# Altium schematic sheet LEFT_MOTOR.SchDoc
size A4; SheetNumber: 2; SheetTotal: 3
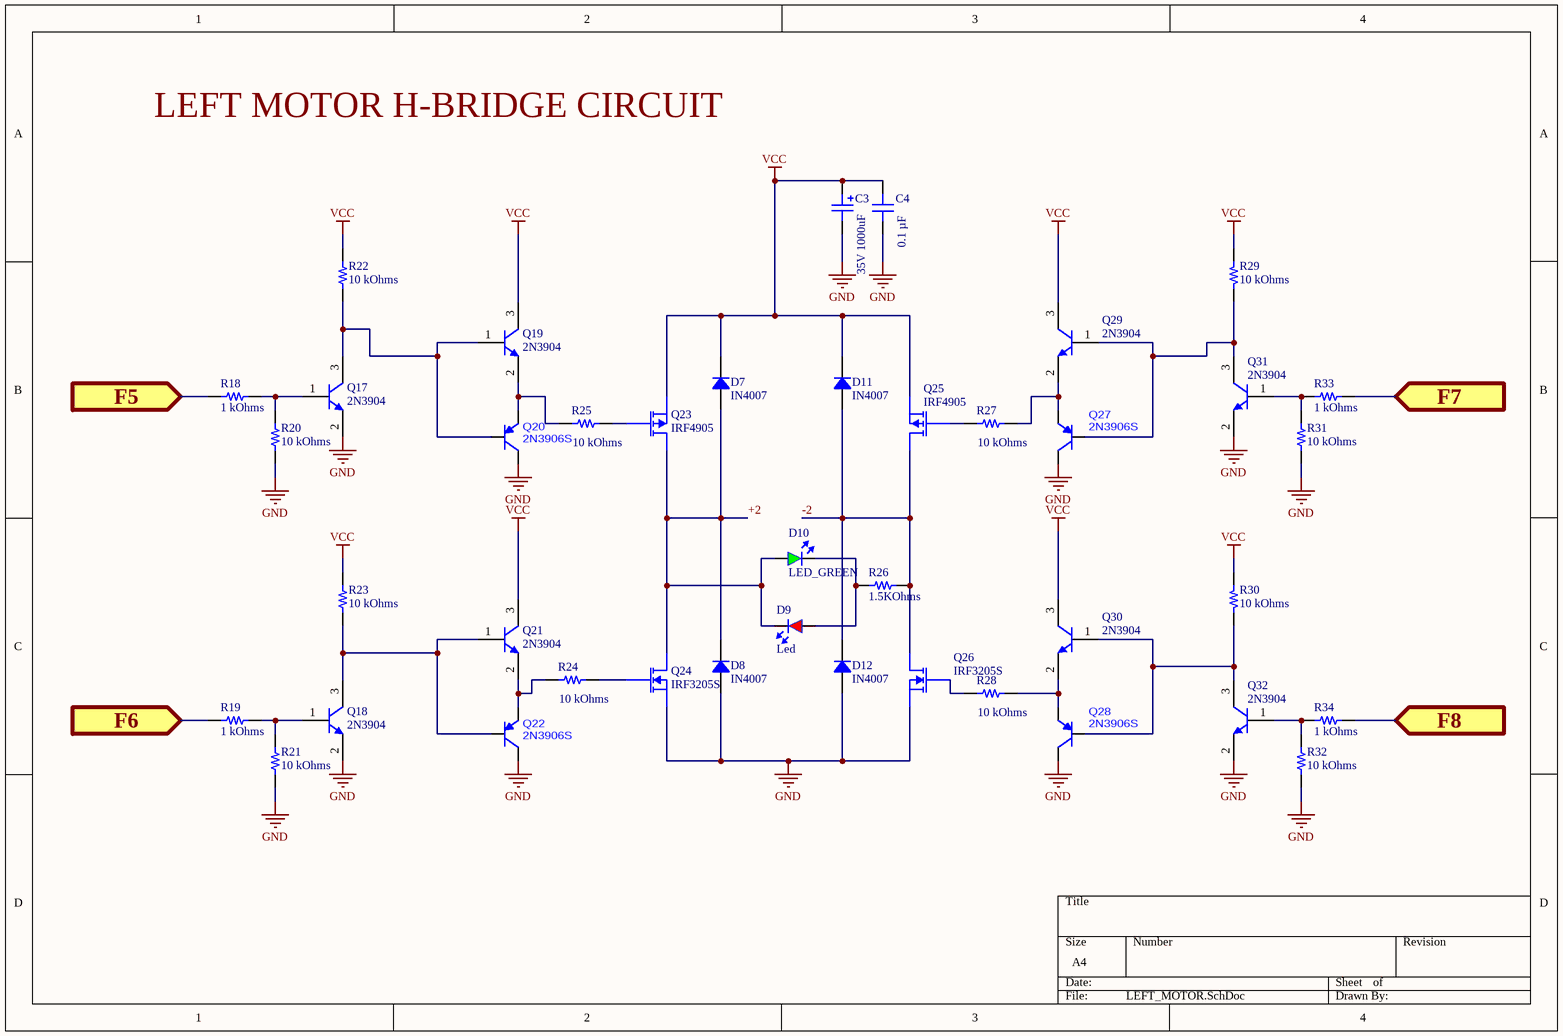
[diagram p0: LEFT_MOTOR.SchDoc]

## Parts
C3  35V 1000uF  [35V 1000uF]
C4  0.1 µF  [CAP 1210_3225 - 1MM]
D7  IN4007  [DO214AC SMA]
D8  IN4007  [DO214AC SMA]
D9  Led  [LED_RED]
D10  LED_GREEN  [LED_GREEN]
D11  IN4007  [DO214AC SMA]
D12  IN4007  [DO214AC SMA]
Q17  2N3904  [DIODES SOT-23-3]
Q18  2N3904  [DIODES SOT-23-3]
Q19  2N3904  [DIODES SOT-23-3]
Q20  2N3906S  [SOT23-3]
Q21  2N3904  [DIODES SOT-23-3]
Q22  2N3906S  [SOT23-3]
Q23  IRF4905  [IRF4905]
Q24  IRF3205S  [IRF3205S]
Q25  IRF4905  [IRF4905]
Q26  IRF3205S  [IRF3205S]
Q27  2N3906S  [SOT23-3]
Q28  2N3906S  [SOT23-3]
Q29  2N3904  [DIODES SOT-23-3]
Q30  2N3904  [DIODES SOT-23-3]
Q31  2N3904  [DIODES SOT-23-3]
Q32  2N3904  [DIODES SOT-23-3]
R18  1 kOhms  [RES 1206_3216]
R19  1 kOhms  [RES 1206_3216]
R20  10 kOhms  [RES 1206_3216]
R21  10 kOhms  [RES 1206_3216]
R22  10 kOhms  [RES 1210_3225]
R23  10 kOhms  [RES 1210_3225]
R24  10 kOhms  [RES 1210_3225]
R25  10 kOhms  [RES 1210_3225]
R26  1.5KOhms  [RES 1210_3225]
R27  10 kOhms  [RES 1210_3225]
R28  10 kOhms  [RES 1210_3225]
R29  10 kOhms  [RES 1210_3225]
R30  10 kOhms  [RES 1210_3225]
R31  10 kOhms  [RES 1206_3216]
R32  10 kOhms  [RES 1206_3216]
R33  1 kOhms  [RES 1206_3216]
R34  1 kOhms  [RES 1206_3216]

## Ports
F5 (in, see LOGIC AND POWER[2D]), F6 (in, see LOGIC AND POWER[2C], LOGIC AND POWER[2D]), F7 (in, see LOGIC AND POWER[2D]), F8 (in, see LOGIC AND POWER[2C], LOGIC AND POWER[2D])

## Nets
GND: C3.2(out) C4.1 D8.1 D12.1 Q17.2(E) Q18.2(E) Q20.3(C) Q22.3(C) Q24.3(S) Q26.3(S) Q27.3(C) Q28.3(C) Q31.2(E) Q32.2(E) R20.1 R21.1 R31.1 R32.1
VCC: C3.1(in) C4.2 D7.2 D11.2 Q19.3(C) Q21.3(C) Q23.3(S) Q25.3(S) Q29.3(C) Q30.3(C) R22.1 R23.1 R29.1 R30.1
+2: D7.1 D8.2 D9.2(OUT) D10.1(IN) Q23.2(D) Q24.2(D)
-2: D11.1 D12.2 Q25.2(D) Q26.2(D) R26.2
F5: R18.1 ; port F5
F6: R19.1 ; port F6
F7: R33.2 ; port F7
F8: R34.2 ; port F8
NetD9_1: D9.1(IN) D10.2(OUT) R26.1
NetQ17_1: Q17.1(B) R18.2 R20.2
NetQ17_3: Q17.3(C) Q19.1(B) Q20.1(B) R22.2
NetQ18_1: Q18.1(B) R19.2 R21.2
NetQ18_3: Q18.3(C) Q21.1(B) Q22.1(B) R23.2
NetQ19_2: Q19.2(E) Q20.2(E) R25.1
NetQ21_2: Q21.2(E) Q22.2(E) R24.1
NetQ23_1: Q23.1(G) R25.2
NetQ24_1: Q24.1(G) R24.2
NetQ25_1: Q25.1(G) R27.1
NetQ26_1: Q26.1(G) R28.1
NetQ27_1: Q27.1(B) Q29.1(B) Q31.3(C) R29.2
NetQ27_2: Q27.2(E) Q29.2(E) R27.2
NetQ28_1: Q28.1(B) Q30.1(B) Q32.3(C) R30.2
NetQ28_2: Q28.2(E) Q30.2(E) R28.2
NetQ31_1: Q31.1(B) R31.2 R33.1
NetQ32_1: Q32.1(B) R32.2 R34.1

## Notes on the sheet
- Labels drawn without touching a wire or pin: LEFT MOTOR H-BRIDGE CIRCUIT

## Library data of the parts
C4 = 1210Y0500104KST: 1210 50VDC 100NF 10% X7R(2R1) AE; manufacturer: Knowles Syfer; Voltage - Rated: 50V; Part Number: 1210Y0500104KST; Value: 0.1 µF; Applications: Automotive, Boardflex Sensitive; Capacitance: 0.1 µF; componentlink2description: DigiKey Link; componentlink2url: https://www.digikey.com/en/products/detail/knowles-syfer/1210Y0500104KST/18879780; Device Package: 1210 (3225 Metric); Features: Soft Termination; lastupdated: 4.12.2023 20:40:02; Lifecycle Status: Active; Minimum Order: 1; Mounting Type: Surface Mount, MLCC; Operating Temperature: -55°C ~ 125°C; Package / Case: 1210 (3225 Metric); packaging: TapeAndReel; partid: 53037; Part Status: Active; price: 0.16; Ratings: AEC-Q200; series: FlexiCap™; Size / Dimension: 0.126" L x 0.098" W (3.20mm x 2.50mm); Supplier 1: DigiKey; Supplier Part Number 1: 1608-1210Y0500104KSTCT-ND; Temperature Coefficient: X7R (2R1); Thickness (Max): 0.079" (2.00mm); Tolerance: ±10%
D7 D8 D11 D12 = RS1A: DIODE GEN PURP 50V 1A SMA; Part Number: RS1A; Manufacturer: ON Semiconductor; Capacitance @ Vr, F: 10pF @ 4V, 1MHz; Current - Reverse Leakage @ Vr: 5µA @ 50V; Diode Type: Standard; Reverse Recovery Time (trr): 150ns; Speed: Fast Recovery =< 500ns, > 200mA (Io); Voltage - Forward (Vf) (Max) @ If: 1.3V @ 1A; ComponentLink1Description: Datasheet; ComponentLink1URL: https://www.onsemi.com/pub/Collateral/RS1M-D.PDF; ComponentLink2Description: DigiKey Link; ComponentLink2URL: http://digikey.com/product-detail/en/on-semiconductor/RS1A/RS1ACT-ND/3504478; Current - Average Rectified (Io): 1A; LastUpdated: 4.12.2023 21:20:44; Lifecycle Status: Active; Minimum Order: 1; Mounting Type: Surface Mount; Operating Temperature - Junction: -55°C ~ 150°C; Package / Case: DO-214AC, SMA; Packaging: TapeAndReel; PartId: 585; Part Status: Active; Price: 0.08; Series: -; Supplier 1: DigiKey; Supplier Part Number 1: RS1ACT-ND; Supplier Device Package: SMA (DO-214AC); Voltage - DC Reverse (Vr) (Max): 50V
D9 = LED_RED_1
Q17-Q19 Q21 Q29-Q32 = MMBT3904-7-F: 2N3904 Npn Smd Transistör Sot-23; Manufacturer: Diodes Incorporated; Current - Collector Cutoff (Max): 50nA (ICBO); Current - Collector (Ic) (Max): 200 mA; DC Current Gain (hFE) (Min) @ Ic, Vce: 100 @ 10mA, 1V; Frequency - Transition: 300MHz; Power - Max: 300 mW; Vce Saturation (Max) @ Ib, Ic: 300mV @ 5mA, 50mA; Voltage - Collector Emitter Breakdown (Max): 40 V; Part Number: MMBT3904-7-F; ComponentLink1Description: Datasheet; ComponentLink1URL: https://www.diodes.com/assets/Datasheets/ds30036.pdf; ComponentLink2Description: DigiKey Link; ComponentLink2URL: https://www.digikey.com/en/products/detail/diodes-incorporated/MMBT3904-7-F/814494; LastUpdated: 4.12.2023 21:46:05; Lifecycle Status: Active; Minimum Order: 1; Mounting Type: Surface Mount; Operating Temperature: -55°C ~ 150°C (TJ); Package / Case: TO-236-3, SC-59, SOT-23-3; Packaging: TapeAndReel; PartId: 85; Part Status: Active; Price: 0.01; Series: -; Supplier 1: DigiKey; Supplier Part Number 1: MMBT3904-FDICT-ND; Supplier Device Package: SOT-23-3; Transistor Type: NPN
R18 R19 R33 R34 = RNCS1206BKE1K00: RES 1K OHM 0.1% 1/8W 1206; Manufacturer: Stackpole Electronics Inc; Power (Watts): 0.125W, 1/8W; Temperature Coefficient: ±25ppm/°C; Part Number: RNCS1206BKE1K00; ComponentLink1Description: Datasheet; ComponentLink1URL: https://www.seielect.com/catalog/sei-rncs_rnch.pdf; ComponentLink2Description: DigiKey Link; ComponentLink2URL: https://www.digikey.com/en/products/detail/stackpole-electronics-inc/RNCS1206BKE1K00/1800333; Composition: Thin Film; Device Package: 1206 (3216 Metric); Features: Anti-Corrosive, Automotive AEC-Q200, Moisture Resistant; Height - Seated (Max): 0.026" (0.65mm); LastUpdated: 4.12.2023 20:49:28; Lifecycle Status: Active; Minimum Order: 1; Number of Terminations: 2; Operating Temperature: -55°C ~ 155°C; Package / Case: 1206 (3216 Metric); Packaging: TapeAndReel; PartId: 26856; Part Status: Active; Price: 0.08; Ratings: AEC-Q200; Resistance: 1 kOhms; Series: RNCS; Size / Dimension: 0.120" L x 0.061" W (3.05mm x 1.55mm); Supplier 1: DigiKey; Supplier Part Number 1: RNCS1206BKE1K00CT-ND; Supplier Device Package: 1206; Tolerance: ±0.1%; Value: 1 kOhms
R20 R21 R31 R32 = CRG1206F10K: RES SMD 10K OHM 1% 1/4W 1206; Manufacturer: TE Connectivity Passive Product; Power (Watts): 0.25W, 1/4W; Temperature Coefficient: ±100ppm/°C; Part Number: CRG1206F10K; ComponentLink1Description: Datasheet; ComponentLink1URL: https://www.te.com/commerce/DocumentDelivery/DDEController?Action=srchrtrv&DocNm=1773204&DocType=DS&DocLang=English; ComponentLink2Description: DigiKey Link; ComponentLink2URL: https://www.digikey.com/en/products/detail/te-connectivity-passive-product/CRG1206F10K/2389909; Composition: Thick Film; Device Package: 1206 (3216 Metric); Height - Seated (Max): 0.026" (0.65mm); LastUpdated: 10.12.2023 20:48:33; Lifecycle Status: Active; Minimum Order: 1; Number of Terminations: 2; Operating Temperature: -55°C ~ 155°C; Package / Case: 1206 (3216 Metric); Packaging: TapeAndReel; PartId: 26989; Part Status: Active; Price: 0.01; Resistance: 10 kOhms; Series: CRG, Neohm; Size / Dimension: 0.122" L x 0.061" W (3.10mm x 1.55mm); Supplier 1: DigiKey; Supplier Part Number 1: A106069CT-ND; Supplier Device Package: 1206; Tolerance: ±1%; Value: 10 kOhms
R22 R23 R29 R30 = CRCW121010K0JNEAHP: RES SMD 10K OHM 5% 3/4W 1210; Manufacturer: Vishay Dale; Power (Watts): 0.75W, 3/4W; Temperature Coefficient: ±200ppm/°C; Part Number: CRCW121010K0JNEAHP; ComponentLink1Description: Datasheet; ComponentLink1URL: http://www.vishay.com/docs/20043/crcwhpe3.pdf; ComponentLink2Description: DigiKey Link; ComponentLink2URL: https://www.digikey.com/en/products/detail/vishay-dale/CRCW121010K0JNEAHP/2567300; Composition: Thick Film; Device Package: 1210 (3225 Metric); Features: Automotive AEC-Q200, Pulse Withstanding; Height - Seated (Max): 0.028" (0.70mm); LastUpdated: 4.12.2023 21:41:47; Lifecycle Status: Active; Minimum Order: 1; Number of Terminations: 2; Operating Temperature: -55°C ~ 155°C; Package / Case: 1210 (3225 Metric); Packaging: TapeAndReel; Part Status: Active; Price: 0.12; Ratings: AEC-Q200; Resistance: 10 kOhms; Series: CRCW-HP; Size / Dimension: 0.126" L x 0.098" W (3.20mm x 2.50mm); Supplier 1: DigiKey; Supplier Part Number 1: 541-10KNCT-ND; Supplier Device Package: 1210; Tolerance: ±5%; Value: 10 kOhms
R24 R25 R27 R28 = RMCF1210FT10K0: RES 10K OHM 1% 1/2W 1210; Manufacturer: Stackpole Electronics Inc; Power (Watts): 0.5W, 1/2W; Temperature Coefficient: ±100ppm/°C; Part Number: RMCF1210FT10K0; ComponentLink1Description: Datasheet; ComponentLink1URL: https://www.seielect.com/catalog/sei-rmcf_rmcp.pdf; ComponentLink2Description: DigiKey Link; ComponentLink2URL: https://www.digikey.com/en/products/detail/stackpole-electronics-inc/RMCF1210FT10K0/1758528; Composition: Thick Film; Device Package: 1210 (3225 Metric); Features: Automotive AEC-Q200; Height - Seated (Max): 0.028" (0.70mm); LastUpdated: 10.12.2023 21:39:36; Lifecycle Status: Active; Minimum Order: 1; Number of Terminations: 2; Operating Temperature: -55°C ~ 155°C; Package / Case: 1210 (3225 Metric); Packaging: TapeAndReel; Part Status: Active; Price: 0.01; Ratings: AEC-Q200; Resistance: 10 kOhms; Series: RMCF; Size / Dimension: 0.126" L x 0.098" W (3.20mm x 2.50mm); Supplier 1: DigiKey; Supplier Part Number 1: RMCF1210FT10K0CT-ND; Supplier Device Package: 1210; Tolerance: ±1%; Value: 10 kOhms
R26 = RMCF1210FT10K0: RES 10K OHM 1% 1/2W 1210; Manufacturer: Stackpole Electronics Inc; Power (Watts): 0.5W, 1/2W; Resistance: 10 kOhms; Temperature Coefficient: ±100ppm/°C; Value: 10 kOhms; Part Number: RMCF1210FT10K0; ComponentLink1Description: Datasheet; ComponentLink1URL: https://www.seielect.com/catalog/sei-rmcf_rmcp.pdf; ComponentLink2Description: DigiKey Link; ComponentLink2URL: https://www.digikey.com/en/products/detail/stackpole-electronics-inc/RMCF1210FT10K0/1758528; Composition: Thick Film; Device Package: 1210 (3225 Metric); Features: Automotive AEC-Q200; Height - Seated (Max): 0.028" (0.70mm); LastUpdated: 4.12.2023 21:41:44; Lifecycle Status: Active; Minimum Order: 1; Number of Terminations: 2; Operating Temperature: -55°C ~ 155°C; Package / Case: 1210 (3225 Metric); Packaging: TapeAndReel; Part Status: Active; Price: 0.01; Ratings: AEC-Q200; Series: RMCF; Size / Dimension: 0.126" L x 0.098" W (3.20mm x 2.50mm); Supplier 1: DigiKey; Supplier Part Number 1: RMCF1210FT10K0CT-ND; Supplier Device Package: 1210; Tolerance: ±1%